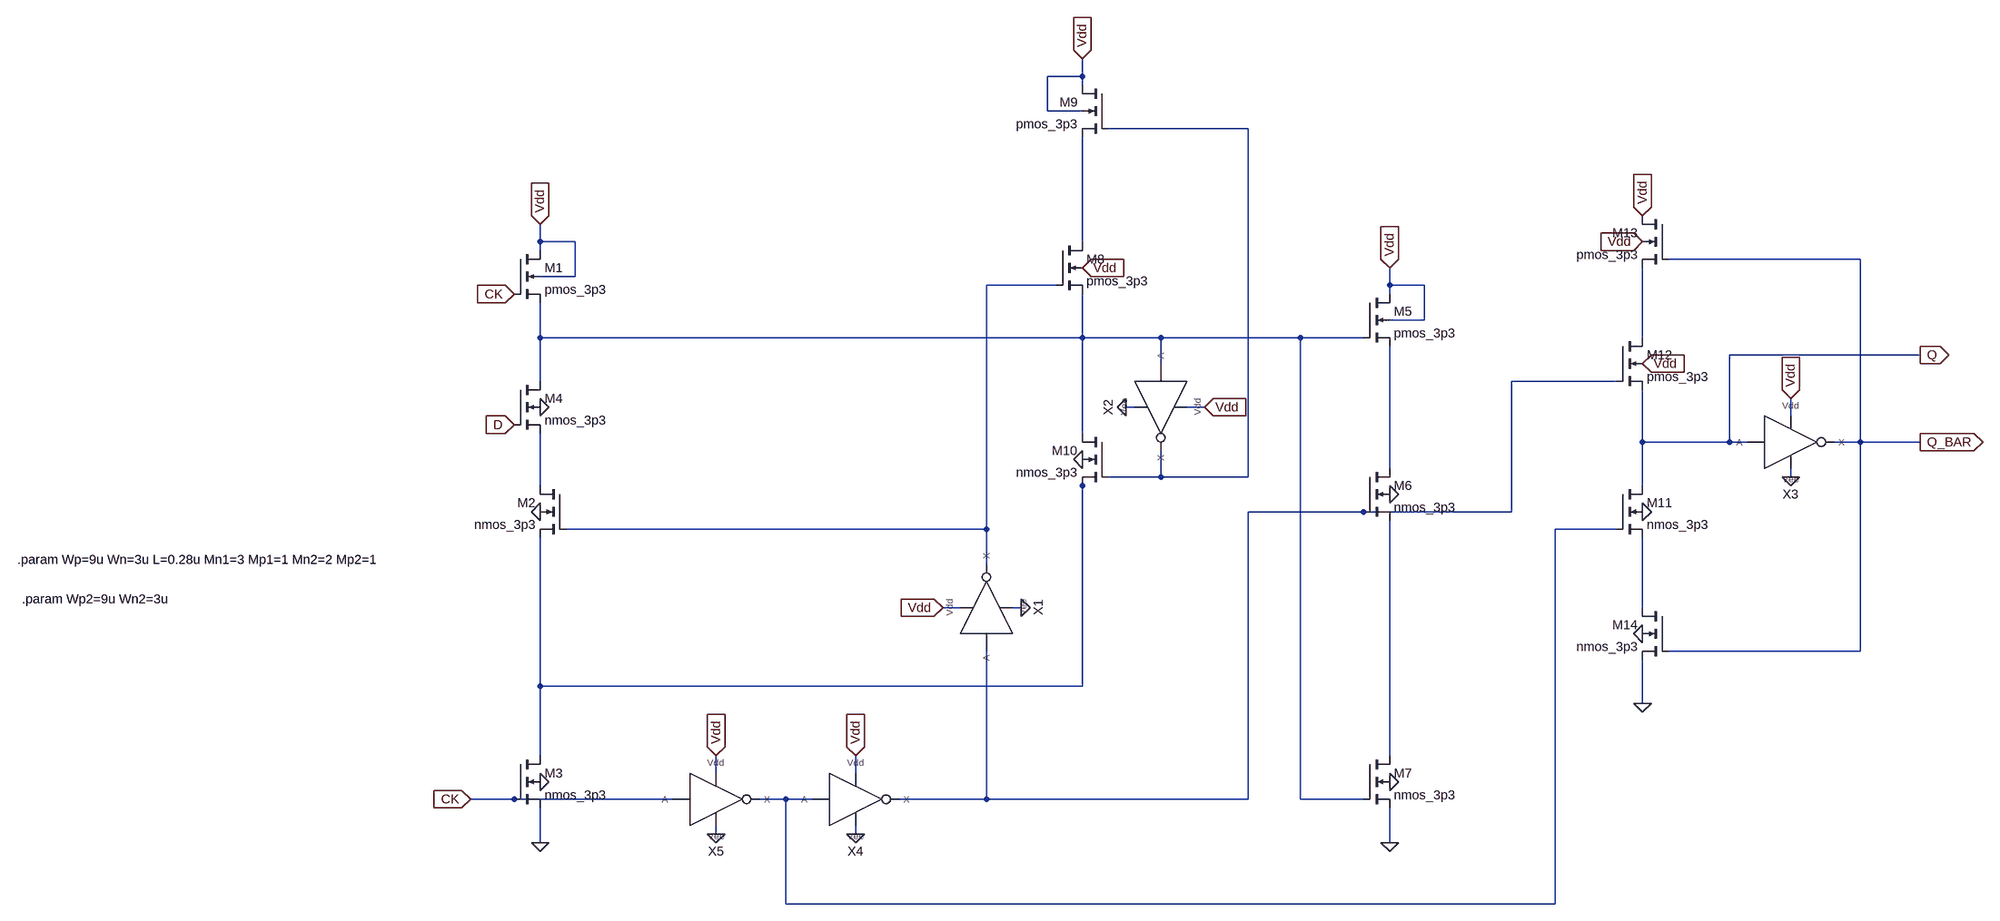
[diagram p0: schematic Draft2.asc]
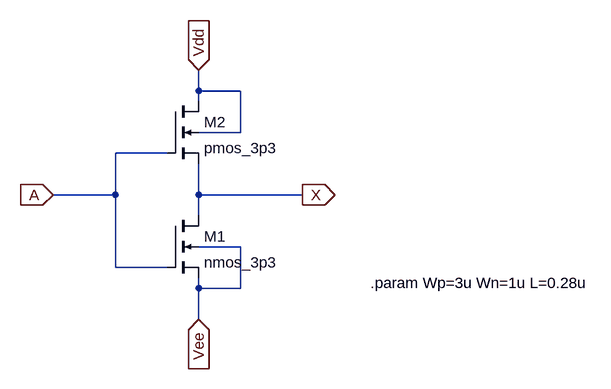
[diagram p1: sub-circuit invx1.asc]
Draft2.asc, the LTspice schematic file:
Version 4
SHEET 1 1436 884
WIRE -464 -640 -464 -672
WIRE -464 -640 -528 -640
WIRE -464 -624 -464 -640
WIRE -528 -576 -528 -640
WIRE -464 -576 -528 -576
WIRE -160 -544 -416 -544
WIRE -1472 -336 -1472 -368
WIRE -1408 -336 -1472 -336
WIRE -464 -336 -464 -528
WIRE -1472 -320 -1472 -336
WIRE 1024 -304 672 -304
WIRE -1408 -272 -1408 -336
WIRE -1408 -272 -1472 -272
WIRE -512 -256 -640 -256
WIRE 160 -256 160 -288
WIRE 224 -256 160 -256
WIRE 160 -240 160 -256
WIRE 224 -192 224 -256
WIRE 224 -192 160 -192
WIRE -1472 -160 -1472 -224
WIRE -464 -160 -464 -240
WIRE -464 -160 -1472 -160
WIRE -320 -160 -464 -160
WIRE -64 -160 -320 -160
WIRE 112 -160 -64 -160
WIRE 624 -160 624 -288
WIRE 1200 -128 784 -128
WIRE -320 -112 -320 -160
WIRE -1472 -80 -1472 -160
WIRE 576 -80 384 -80
WIRE -368 -32 -384 -32
WIRE -240 -32 -272 -32
WIRE 896 -16 896 -48
WIRE -464 16 -464 -160
WIRE 624 32 624 -64
WIRE 784 32 784 -128
WIRE 784 32 624 32
WIRE 816 32 784 32
WIRE 1024 32 1024 -304
WIRE 1024 32 976 32
WIRE 1200 32 1024 32
WIRE 160 80 160 -144
WIRE -320 96 -320 48
WIRE -320 96 -416 96
WIRE -160 96 -160 -544
WIRE -160 96 -320 96
WIRE 896 96 896 80
WIRE -1472 112 -1472 16
WIRE -464 112 -464 96
WIRE 624 112 624 32
WIRE 112 160 -160 160
WIRE 384 160 384 -80
WIRE 384 160 112 160
WIRE -640 192 -640 -256
WIRE -640 192 -1424 192
WIRE 576 192 464 192
WIRE -640 256 -640 192
WIRE -688 336 -720 336
WIRE -576 336 -592 336
WIRE 624 336 624 208
WIRE 1024 416 1024 32
WIRE 1024 416 672 416
WIRE -1472 480 -1472 208
WIRE -464 480 -464 112
WIRE -464 480 -1472 480
WIRE 624 512 624 432
WIRE -1472 608 -1472 480
WIRE 160 608 160 176
WIRE -1136 640 -1136 608
WIRE -880 640 -880 608
WIRE -1520 688 -1600 688
WIRE -1216 688 -1520 688
WIRE -1008 688 -1056 688
WIRE -960 688 -1008 688
WIRE -640 688 -640 416
WIRE -640 688 -800 688
WIRE -160 688 -160 160
WIRE -160 688 -640 688
WIRE -64 688 -64 -160
WIRE 112 688 -64 688
WIRE -1136 752 -1136 736
WIRE -880 752 -880 736
WIRE -1472 768 -1472 704
WIRE 160 768 160 704
WIRE -1008 880 -1008 688
WIRE 464 880 464 192
WIRE 464 880 -1008 880
FLAG -1472 -368 Vdd
IOPIN -1472 -368 In
FLAG -1520 -240 CK
IOPIN -1520 -240 In
FLAG -1472 768 0
FLAG -1520 0 D
IOPIN -1520 0 In
FLAG 1200 -128 Q
IOPIN 1200 -128 Out
FLAG 1200 32 Q_BAR
IOPIN 1200 32 Out
FLAG -1472 656 0
FLAG -1472 160 0
FLAG -1472 -32 0
FLAG 160 -288 Vdd
IOPIN 160 -288 In
FLAG 160 768 0
FLAG 160 656 0
FLAG 160 128 0
FLAG -1600 688 CK
IOPIN -1600 688 In
FLAG -880 752 0
FLAG -1136 752 0
FLAG -880 608 Vdd
IOPIN -880 608 In
FLAG -1136 608 Vdd
IOPIN -1136 608 In
FLAG -576 336 0
FLAG -720 336 Vdd
IOPIN -720 336 In
FLAG -464 -672 Vdd
IOPIN -464 -672 In
FLAG -464 64 0
FLAG -384 -32 0
FLAG -240 -32 Vdd
IOPIN -240 -32 In
FLAG -464 -288 Vdd
IOPIN -464 -288 In
FLAG 624 160 0
FLAG 624 -112 Vdd
IOPIN 624 -112 In
FLAG 624 -336 Vdd
IOPIN 624 -336 In
FLAG 624 -384 Vdd
IOPIN 624 -384 In
FLAG 896 96 0
FLAG 896 -48 Vdd
IOPIN 896 -48 In
FLAG 624 384 0
FLAG 624 512 0
SYMBOL nmos4 -1520 -320 R0
SYMATTR InstName M1
SYMATTR Value pmos_3p3
SYMATTR Value2 l={L} w={Wp} m={Mp1}
SYMBOL nmos4 -1424 112 M0
SYMATTR InstName M2
SYMATTR Value nmos_3p3
SYMATTR Value2 l={L} w={Wn} m={Mn1}
SYMBOL nmos4 -1520 608 R0
SYMATTR InstName M3
SYMATTR Value nmos_3p3
SYMATTR Value2 l={L} w={Wn} m={Mn1}
SYMBOL nmos4 -1520 -80 R0
SYMATTR InstName M4
SYMATTR Value nmos_3p3
SYMATTR Value2 l={L} w={Wn} m={Mn1}
SYMBOL nmos4 112 -240 R0
SYMATTR InstName M5
SYMATTR Value pmos_3p3
SYMATTR Value2 l={L} w={Wp2} m={Mp2}
SYMBOL nmos4 112 80 R0
SYMATTR InstName M6
SYMATTR Value nmos_3p3
SYMATTR Value2 l={L} w={Wn2} m={Mn2}
SYMBOL nmos4 112 608 R0
SYMATTR InstName M7
SYMATTR Value nmos_3p3
SYMATTR Value2 l={L} w={Wn2} m={Mn2}
SYMBOL INVx1 -880 688 R0
SYMATTR InstName X4
SYMBOL INVx1 -1136 688 R0
SYMATTR InstName X5
SYMBOL INVx1 -640 336 R270
SYMATTR InstName X1
SYMBOL nmos4 -512 -336 R0
SYMATTR InstName M8
SYMATTR Value pmos_3p3
SYMATTR Value2 l={L} w={Wp} m={Mp1}
SYMBOL nmos4 -416 -624 M0
SYMATTR InstName M9
SYMATTR Value pmos_3p3
SYMATTR Value2 l={L} w={Wp} m={Mp1}
SYMBOL nmos4 -416 16 M0
SYMATTR InstName M10
SYMATTR Value nmos_3p3
SYMATTR Value2 l={L} w={Wn} m={Mn1}
SYMBOL INVx1 -320 -32 R90
SYMATTR InstName X2
SYMBOL nmos4 576 112 R0
SYMATTR InstName M11
SYMATTR Value nmos_3p3
SYMATTR Value2 l={L} w={Wn2} m={Mn2}
SYMBOL nmos4 576 -160 R0
SYMATTR InstName M12
SYMATTR Value pmos_3p3
SYMATTR Value2 l={L} w={Wp} m={Mp1}
SYMBOL nmos4 672 -384 M0
SYMATTR InstName M13
SYMATTR Value pmos_3p3
SYMATTR Value2 l={L} w={Wp} m={Mp1}
SYMBOL INVx1 896 32 R0
SYMATTR InstName X3
SYMBOL nmos4 672 336 M0
SYMATTR InstName M14
SYMATTR Value nmos_3p3
SYMATTR Value2 l={L} w={Wn2} m={Mn2}
TEXT -2528 248 Left 2 !.param Wp=9u Wn=3u L=0.28u Mn1=3 Mp1=1 Mn2=2 Mp2=1
TEXT -2520 320 Left 2 !.param Wp2=9u Wn2=3u

invx1.asc, the sub-circuit schematic file:
Version 4.1
SHEET 1 2776 836
WIRE 416 -16 416 -48
WIRE 480 -16 416 -16
WIRE 416 0 416 -16
WIRE 480 48 480 -16
WIRE 480 48 416 48
WIRE 368 80 288 80
WIRE 288 144 288 80
WIRE 288 144 192 144
WIRE 416 144 416 96
WIRE 576 144 416 144
WIRE 416 176 416 144
WIRE 480 224 416 224
WIRE 288 256 288 144
WIRE 368 256 288 256
WIRE 416 288 416 272
WIRE 480 288 480 224
WIRE 480 288 416 288
WIRE 416 336 416 288
FLAG 416 -48 Vdd
IOPIN 416 -48 In
FLAG 192 144 A
IOPIN 192 144 In
FLAG 576 144 X
IOPIN 576 144 Out
FLAG 416 336 Vee
IOPIN 416 336 In
SYMBOL nmos4 368 176 R0
SYMATTR InstName M1
SYMATTR Value nmos_3p3
SYMATTR Value2 l={L} w={Wn}
SYMBOL nmos4 368 0 R0
SYMATTR InstName M2
SYMATTR Value pmos_3p3
SYMATTR Value2 l={L} w={Wp}
TEXT 680 280 Left 2 !.param Wp=3u Wn=1u L=0.28u

The netlist it stands for:
* Draft2.asc
M1 Vdd CK N004 Vdd pmos_3p3 l={L} w={Wp} m={Mp1}
M2 N008 N003 N009 0 nmos_3p3 l={L} w={Wn} m={Mn1}
M3 N009 CK 0 0 nmos_3p3 l={L} w={Wn} m={Mn1}
M4 N004 D N008 0 nmos_3p3 l={L} w={Wn} m={Mn1}
M5 Vdd N004 N007 Vdd pmos_3p3 l={L} w={Wp2} m={Mp2}
M6 N007 N006 N012 0 nmos_3p3 l={L} w={Wn2} m={Mn2}
M7 N012 N004 0 0 nmos_3p3 l={L} w={Wn2} m={Mn2}
XX4 N010 Vdd N006 0 invx1
XX5 CK Vdd N010 0 invx1
XX1 N006 Vdd N003 0 invx1
M8 N002 N003 N004 Vdd pmos_3p3 l={L} w={Wp} m={Mp1}
M9 Vdd N001 N002 Vdd pmos_3p3 l={L} w={Wp} m={Mp1}
M10 N004 N001 N009 0 nmos_3p3 l={L} w={Wn} m={Mn1}
XX2 N004 Vdd N001 0 invx1
M11 Q N010 N011 0 nmos_3p3 l={L} w={Wn2} m={Mn2}
M12 N005 N006 Q Vdd pmos_3p3 l={L} w={Wp} m={Mp1}
M13 Vdd Q_BAR N005 Vdd pmos_3p3 l={L} w={Wp} m={Mp1}
XX3 Q Vdd Q_BAR 0 invx1
M14 N011 Q_BAR 0 0 nmos_3p3 l={L} w={Wn2} m={Mn2}

* block symbol definitions
.subckt invx1 A Vdd X Vee
M1 X A Vee Vee nmos_3p3 l={L} w={Wn}
M2 Vdd A X Vdd pmos_3p3 l={L} w={Wp}
.param Wp=3u Wn=1u L=0.28u
.ends invx1

.model NMOS NMOS
.model PMOS PMOS
.lib standard.mos
.param Wp=9u Wn=3u L=0.28u Mn1=3 Mp1=1 Mn2=2 Mp2=1
.param Wp2=9u Wn2=3u
.backanno
.end